# EasyEDA schematic 1-Schematic_mixmult.json
TITLE: Sheet_1; REV: 1.0; Date: 2025-02-06; Sheet: 1/1; Drawn By: t.friedrich-soehner; Company: Your Company
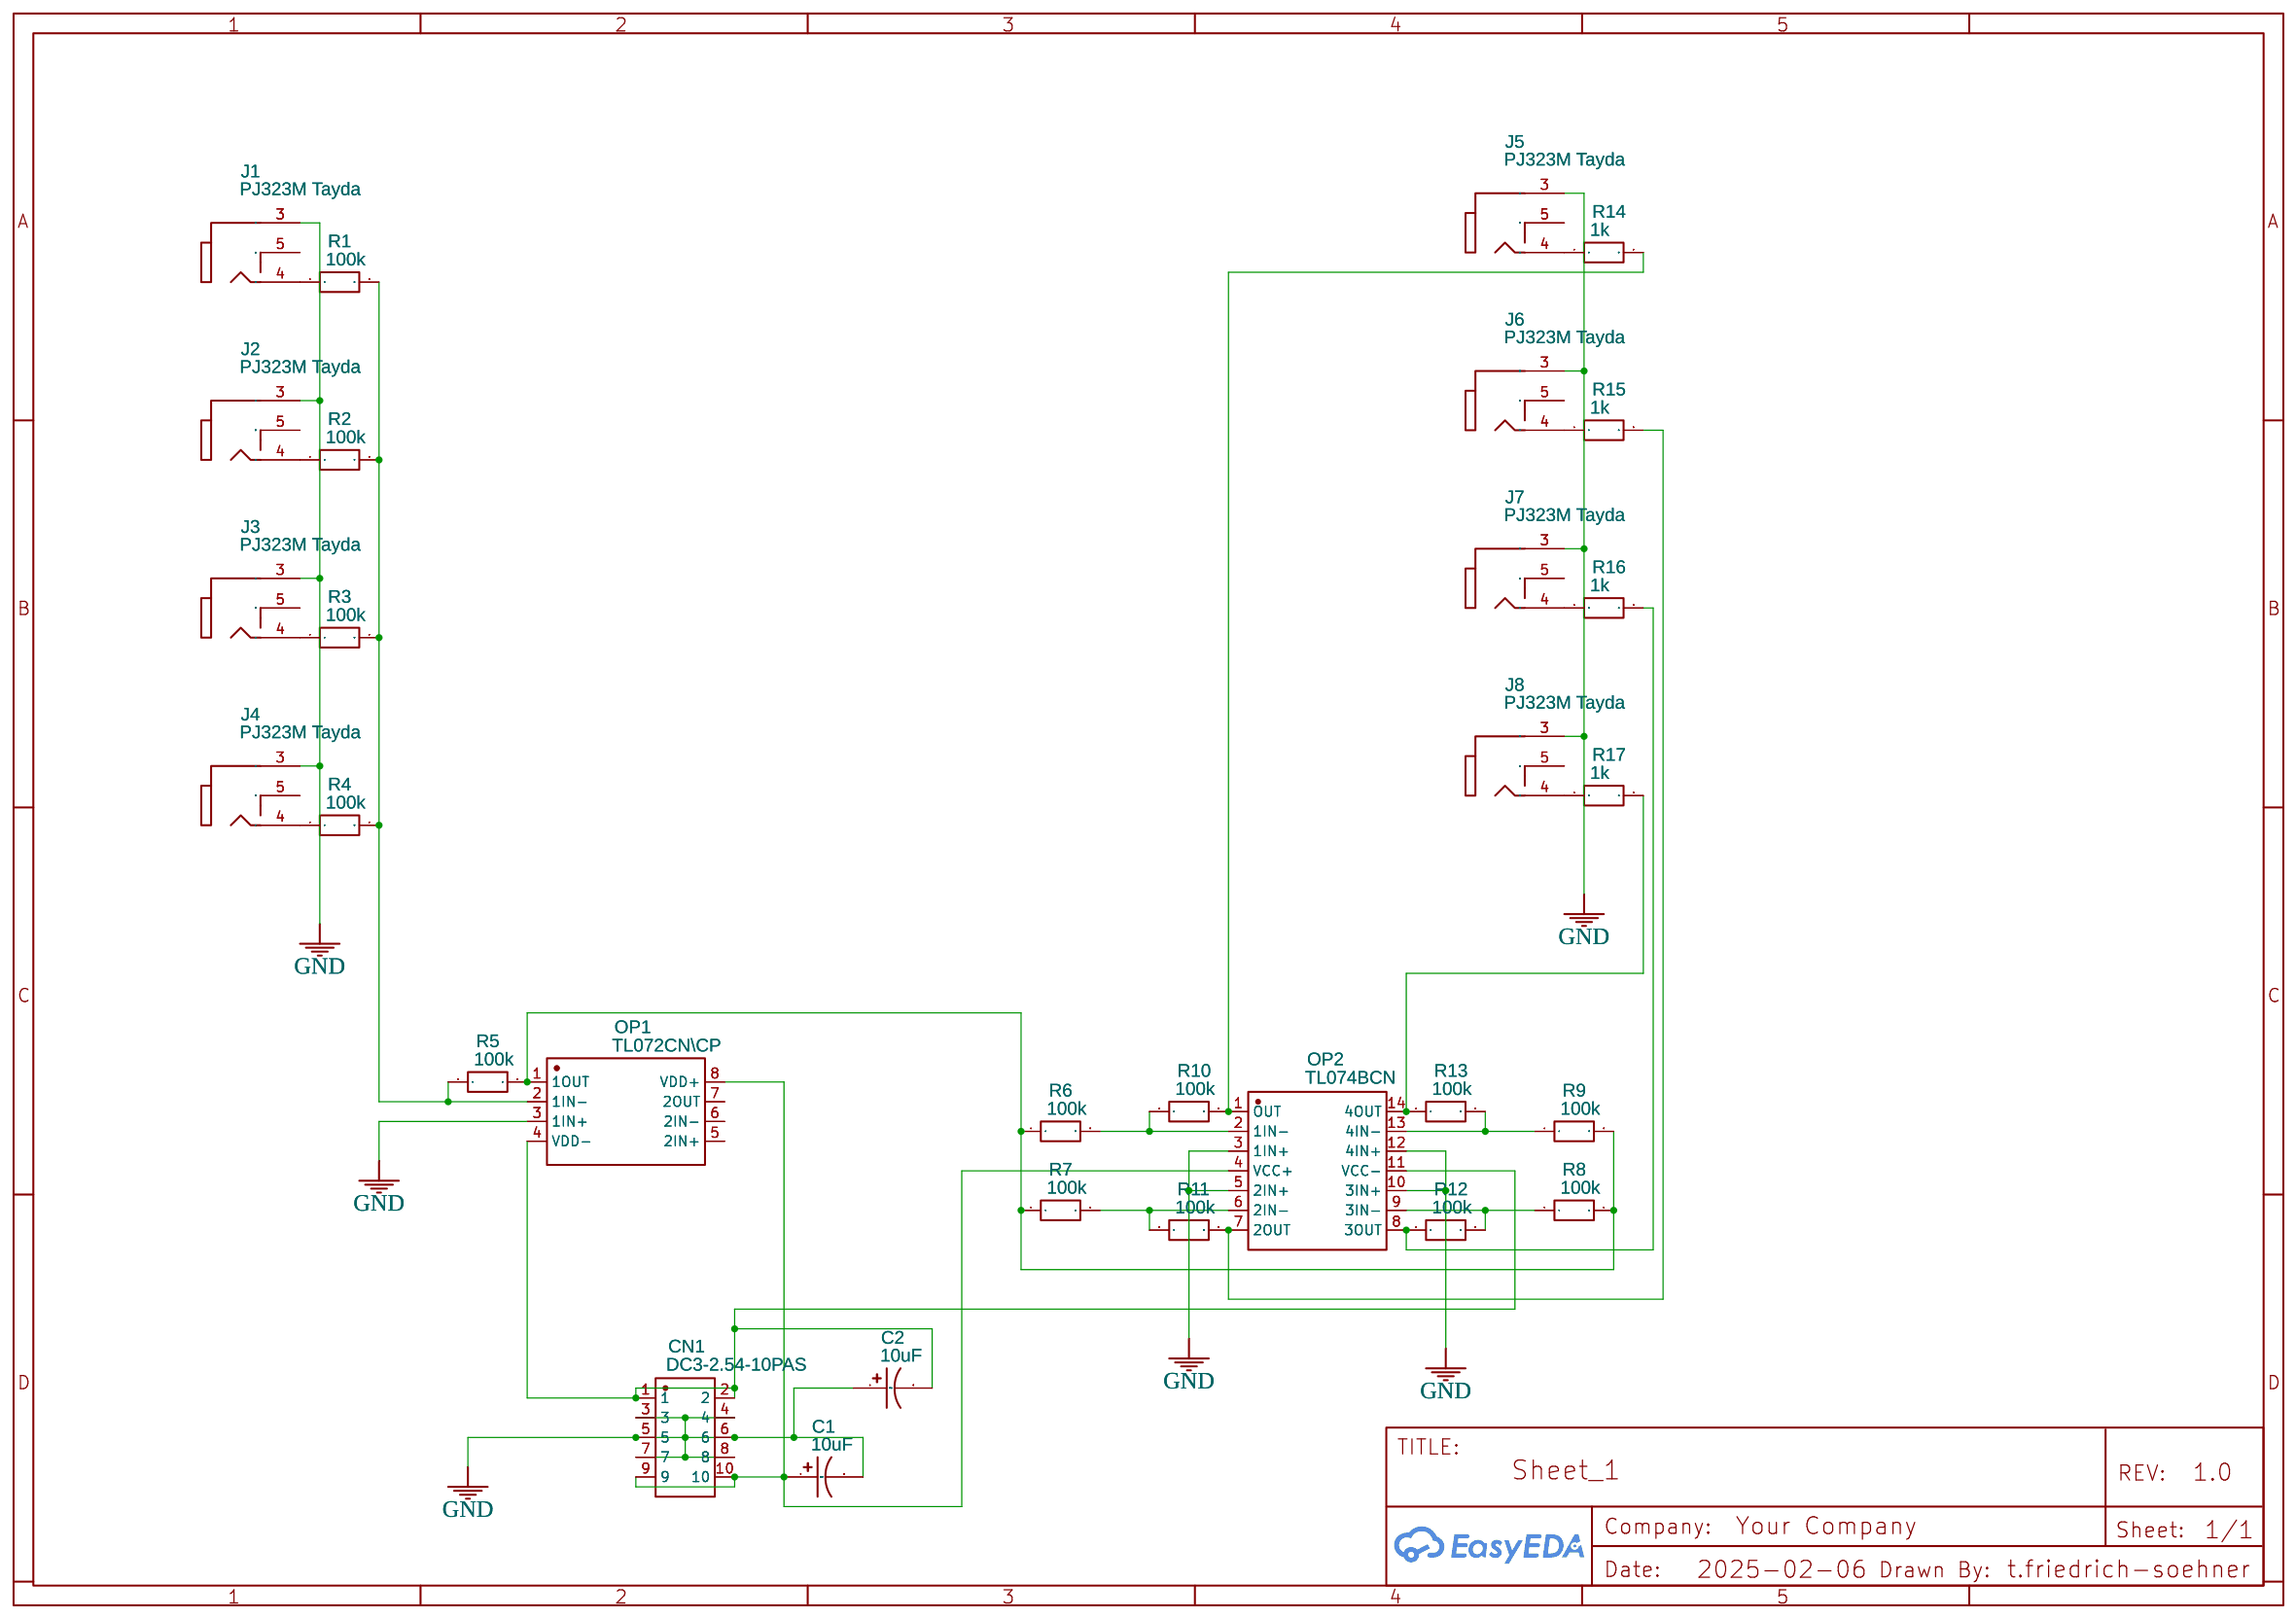
[diagram p0: schematic sheet]

## Parts
C1  10uF  [CAP-TH_BD5.0-P2.00-D0.5-FD]
C2  10uF  [CAP-TH_BD5.0-P2.00-D0.5-FD]
CN1  DC3-2.54-10PAS  [CONN-TH_10P-P2.54_DC3-2.54-10PAS]
J1  PJ323M Tayda  [PJM323 TAYDA A-2557]
J2  PJ323M Tayda  [PJM323 TAYDA A-2557]
J3  PJ323M Tayda  [PJM323 TAYDA A-2557]
J4  PJ323M Tayda  [PJM323 TAYDA A-2557]
J5  PJ323M Tayda  [PJM323 TAYDA A-2557]
J6  PJ323M Tayda  [PJM323 TAYDA A-2557]
J7  PJ323M Tayda  [PJM323 TAYDA A-2557]
J8  PJ323M Tayda  [PJM323 TAYDA A-2557]
OP1  TL072CN\CP  [TL072]
OP2  TL074BCN  [PDIP-14_L19.3-W6.5-P2.54-LS7.6-BL]
R1  100k  [RES-TH_BD2.4-L6.3-P10.30-D0.6]
R2  100k  [RES-TH_BD2.4-L6.3-P10.30-D0.6]
R3  100k  [RES-TH_BD2.4-L6.3-P10.30-D0.6]
R4  100k  [RES-TH_BD2.4-L6.3-P10.30-D0.6]
R5  100k  [RES-TH_BD2.4-L6.3-P10.30-D0.6]
R6  100k  [RES-TH_BD2.4-L6.3-P10.30-D0.6]
R7  100k  [RES-TH_BD2.4-L6.3-P10.30-D0.6]
R8  100k  [RES-TH_BD2.4-L6.3-P10.30-D0.6]
R9  100k  [RES-TH_BD2.4-L6.3-P10.30-D0.6]
R10  100k  [RES-TH_BD2.4-L6.3-P10.30-D0.6]
R11  100k  [RES-TH_BD2.4-L6.3-P10.30-D0.6]
R12  100k  [RES-TH_BD2.4-L6.3-P10.30-D0.6]
R13  100k  [RES-TH_BD2.4-L6.3-P10.30-D0.6]
R14  1k  [RES-TH_BD2.4-L6.3-P10.30-D0.6]
R15  1k  [RES-TH_BD2.4-L6.3-P10.30-D0.6]
R16  1k  [RES-TH_BD2.4-L6.3-P10.30-D0.6]
R17  1k  [RES-TH_BD2.4-L6.3-P10.30-D0.6]

## Library data of the parts
C1 C2 = 50MS710MEFCTZ5X7: Contributor: lcsc; Supplier: LCSC; Supplier Part: C5115261; Manufacturer: rubycon(红宝石)
CN1 = DC3-2.54-10PAS: Contributor: lcsc; Supplier: LCSC; Supplier Part: C2977596; Manufacturer: ZHOURI(洲日); JLCPCB Part Class: Extended Part
J1-J8 = PJ323M Tayda: Supplier: Tayda; Supplier Part: A-2557; Contributor: flounderguts
OP1 = TL072CD: Contributor: Shivakumarn
OP2 = TL074BCN: Contributor: LCSC; Supplier: LCSC; Supplier Part: C1346542; Manufacturer: TI(德州仪器); JLCPCB Part Class: Extended Part
R1-R17 = Res_AXIAL-0.4(1/4W)_US

## Nets
GND: C1.2 C2.1 CN1.3 CN1.4 CN1.5 CN1.6 CN1.7 CN1.8 J1.3 J2.3 J3.3 J4.3 J5.3 J6.3 J7.3 J8.3 OP1.3(1IN+) OP2.3(1IN+) OP2.5(2IN+) OP2.10(3IN+) OP2.12(4IN+)
Net-(C1-1): C1.1 CN1.9 CN1.10 OP1.8(VDD+) OP2.4(VCC+)
Net-(C2-2): C2.2 CN1.1 CN1.2 OP1.4(VDD-) OP2.11(VCC-)
Net-(J1-4): J1.4 R1.1
Net-(J2-4): J2.4 R2.1
Net-(J3-4): J3.4 R3.1
Net-(J4-4): J4.4 R4.1
Net-(J5-4): J5.4 R14.1
Net-(J6-4): J6.4 R15.1
Net-(J7-4): J7.4 R16.1
Net-(J8-4): J8.4 R17.1
Net-(OP1-1): OP1.1(1OUT) R5.2 R6.1 R7.1 R8.2 R9.2
Net-(OP1-2): OP1.2(1IN-) R1.2 R2.2 R3.2 R4.2 R5.1
Net-(OP2-1): OP2.1(OUT) R10.2 R14.2
Net-(OP2-2): OP2.2(1IN-) R6.2 R10.1
Net-(OP2-6): OP2.6(2IN-) R7.2 R11.1
Net-(OP2-7): OP2.7(2OUT) R11.2 R15.2
Net-(OP2-8): OP2.8(3OUT) R12.1 R16.2
Net-(OP2-9): OP2.9(3IN-) R8.1 R12.2
Net-(OP2-13): OP2.13(4IN-) R9.1 R13.2
Net-(OP2-14): OP2.14(4OUT) R13.1 R17.2

Not connected (* = marked no-connect by the designer): J1 5; J2 5; J3 5; J4 5; J5 5; J6 5; J7 5; J8 5; OP1 5(2IN+) 6(2IN-) 7(2OUT)
